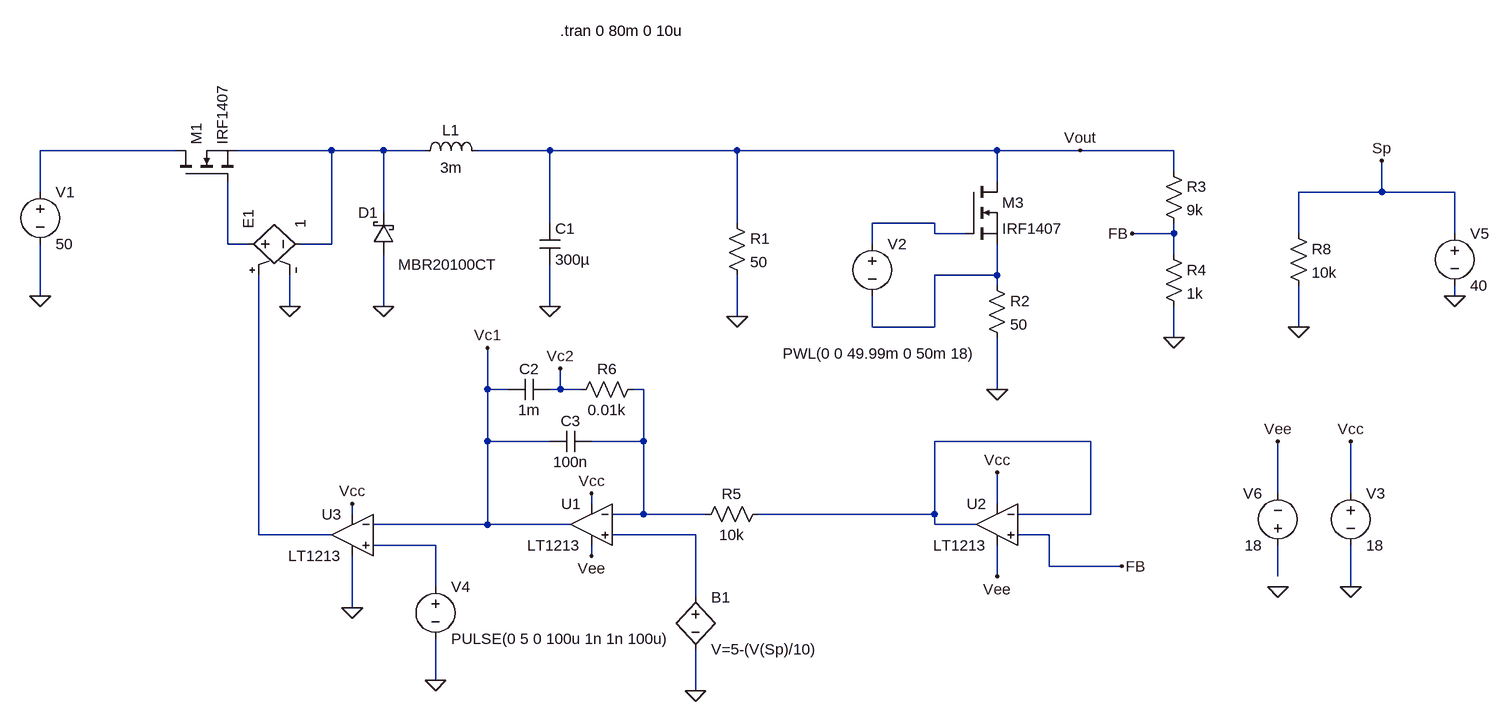
[diagram p0: schematic 12.BuckWithTypeII.asc]
12.BuckWithTypeII.asc, the LTspice schematic file:
Version 4
SHEET 1 2400 1028
WIRE 208 16 0 16
WIRE 448 16 304 16
WIRE 528 16 448 16
WIRE 592 16 528 16
WIRE 784 16 672 16
WIRE 1072 16 784 16
WIRE 1472 16 1072 16
WIRE 1600 16 1472 16
WIRE 1744 16 1600 16
WIRE 1744 48 1744 16
WIRE 1472 64 1472 16
WIRE 0 80 0 16
WIRE 2064 80 2064 32
WIRE 2064 80 1936 80
WIRE 2176 80 2064 80
WIRE 528 112 528 16
WIRE 784 128 784 16
WIRE 1072 128 1072 16
WIRE 1376 128 1280 128
WIRE 1376 144 1376 128
WIRE 1424 144 1376 144
WIRE 1744 144 1744 128
WIRE 1744 144 1680 144
WIRE 1936 144 1936 80
WIRE 2176 144 2176 80
WIRE 288 160 288 64
WIRE 320 160 288 160
WIRE 448 160 448 16
WIRE 448 160 400 160
WIRE 1280 160 1280 128
WIRE 1744 176 1744 144
WIRE 1472 208 1472 160
WIRE 1472 208 1376 208
WIRE 1472 224 1472 208
WIRE 0 240 0 160
WIRE 2176 240 2176 224
WIRE 384 256 384 208
WIRE 528 256 528 176
WIRE 784 256 784 192
WIRE 1072 272 1072 208
WIRE 1280 288 1280 240
WIRE 1376 288 1376 208
WIRE 1376 288 1280 288
WIRE 1936 288 1936 224
WIRE 1744 304 1744 256
WIRE 688 384 688 320
WIRE 720 384 688 384
WIRE 800 384 800 352
WIRE 800 384 784 384
WIRE 832 384 800 384
WIRE 928 384 912 384
WIRE 1472 384 1472 304
WIRE 688 464 688 384
WIRE 784 464 688 464
WIRE 928 464 928 384
WIRE 928 464 848 464
WIRE 1616 464 1376 464
WIRE 1904 544 1904 464
WIRE 2016 544 2016 464
WIRE 848 560 848 544
WIRE 1472 560 1472 512
WIRE 480 576 480 560
WIRE 928 576 928 464
WIRE 928 576 880 576
WIRE 1024 576 928 576
WIRE 1376 576 1376 464
WIRE 1376 576 1104 576
WIRE 1616 576 1616 464
WIRE 1616 576 1504 576
WIRE 688 592 688 464
WIRE 688 592 512 592
WIRE 816 592 688 592
WIRE 1376 592 1376 576
WIRE 1440 592 1376 592
WIRE 336 608 336 208
WIRE 448 608 336 608
WIRE 1008 608 880 608
WIRE 1552 608 1504 608
WIRE 608 624 512 624
WIRE 848 640 848 624
WIRE 1552 656 1552 608
WIRE 1664 656 1552 656
WIRE 1472 672 1472 624
WIRE 1904 672 1904 624
WIRE 608 688 608 624
WIRE 2016 688 2016 624
WIRE 1008 704 1008 608
WIRE 480 720 480 640
WIRE 608 832 608 768
WIRE 1008 848 1008 784
FLAG 0 240 0
FLAG 528 256 0
FLAG 784 256 0
FLAG 1072 272 0
FLAG 1472 384 0
FLAG 1744 304 0
FLAG 1680 144 FB
FLAG 1008 848 0
FLAG 608 832 0
FLAG 1936 288 0
FLAG 2176 240 0
FLAG 2064 32 Sp
FLAG 848 544 Vcc
FLAG 848 640 Vee
FLAG 480 560 Vcc
FLAG 384 256 0
FLAG 2016 688 0
FLAG 1904 688 0
FLAG 2016 464 Vcc
FLAG 1904 464 Vee
FLAG 480 720 0
FLAG 1600 16 Vout
FLAG 688 320 Vc1
FLAG 800 352 Vc2
FLAG 1472 512 Vcc
FLAG 1472 672 Vee
FLAG 1664 656 FB
SYMBOL voltage 0 64 R0
WINDOW 123 0 0 Left 0
WINDOW 39 0 0 Left 0
SYMATTR InstName V1
SYMATTR Value 50
SYMBOL nmos 208 64 R270
SYMATTR InstName M1
SYMATTR Value IRF1407
SYMBOL schottky 544 176 R180
WINDOW 0 24 64 Left 2
WINDOW 3 -160 -16 Left 2
SYMATTR InstName D1
SYMATTR Value MBR20100CT
SYMATTR Description Diode
SYMATTR Type diode
SYMBOL ind 576 32 R270
WINDOW 0 32 56 VTop 2
WINDOW 3 5 56 VBottom 2
SYMATTR InstName L1
SYMATTR Value 3m
SYMBOL cap 768 128 R0
SYMATTR InstName C1
SYMATTR Value 300µ
SYMBOL res 1056 112 R0
SYMATTR InstName R1
SYMATTR Value 50
SYMBOL res 1456 208 R0
SYMATTR InstName R2
SYMATTR Value 50
SYMBOL voltage 1280 144 R0
WINDOW 3 -138 185 Left 2
WINDOW 123 0 0 Left 0
WINDOW 39 0 0 Left 0
SYMATTR InstName V2
SYMATTR Value PWL(0 0 49.99m 0 50m 18)
SYMBOL res 1728 32 R0
SYMATTR InstName R3
SYMATTR Value 9k
SYMBOL res 1728 160 R0
SYMATTR InstName R4
SYMATTR Value 1k
SYMBOL nmos 1424 64 R0
SYMATTR InstName M3
SYMATTR Value IRF1407
SYMBOL OpAmps\\LT1213 848 528 M0
SYMATTR InstName U1
SYMBOL res 1120 560 R90
WINDOW 0 0 56 VBottom 2
WINDOW 3 32 56 VTop 2
SYMATTR InstName R5
SYMATTR Value 10k
SYMBOL res 928 368 R90
WINDOW 0 0 56 VBottom 2
WINDOW 3 32 56 VTop 2
SYMATTR InstName R6
SYMATTR Value 0.01k
SYMBOL cap 784 368 R90
WINDOW 0 0 32 VBottom 2
WINDOW 3 32 32 VTop 2
SYMATTR InstName C2
SYMATTR Value 1m
SYMBOL voltage 608 672 R0
WINDOW 123 0 0 Left 0
WINDOW 39 0 0 Left 0
SYMATTR InstName V4
SYMATTR Value PULSE(0 5 0 100u 1n 1n 100u)
SYMBOL voltage 2176 128 R0
SYMATTR InstName V5
SYMATTR Value 40
SYMBOL res 1920 128 R0
SYMATTR InstName R8
SYMATTR Value 10k
SYMBOL OpAmps\\LT1213 480 544 M0
SYMATTR InstName U3
SYMBOL e 304 160 R270
SYMATTR InstName E1
SYMATTR Value 1
SYMBOL bv 1008 688 R0
SYMATTR InstName B1
SYMATTR Value V=5-(V(Sp)/10)
SYMBOL cap 848 448 R90
WINDOW 0 0 32 VBottom 2
WINDOW 3 32 32 VTop 2
SYMATTR InstName C3
SYMATTR Value 100n
SYMBOL voltage 2016 528 R0
SYMATTR InstName V3
SYMATTR Value 18
SYMBOL voltage 1904 640 R180
WINDOW 0 24 96 Left 2
WINDOW 3 24 16 Left 2
SYMATTR InstName V6
SYMATTR Value 18
SYMBOL OpAmps\\LT1213 1472 528 M0
SYMATTR InstName U2
TEXT 800 -168 Left 2 !.tran 0 80m 0 10u

The netlist it stands for:
* 12.BuckWithTypeII.asc
V1 N001 0 50
M1 N001 N004 N002 N002 IRF1407
D1 0 N002 MBR20100CT
L1 N002 Vout 3m
C1 Vout 0 300µ
R1 Vout 0 50
R2 N005 0 50
V2 N003 N005 PWL(0 0 49.99m 0 50m 18)
R3 Vout FB 9k
R4 FB 0 1k
M3 Vout N003 N005 N005 IRF1407
XU1 N009 N006 Vcc Vee Vc1 LT1213  ; pins In+ In- V+ V- OUT
R5 N007 N006 10k
R6 N006 Vc2 0.01k
C2 Vc2 Vc1 1m
V4 N010 0 PULSE(0 5 0 100u 1n 1n 100u)
V5 Sp 0 40
R8 Sp 0 10k
XU3 N010 Vc1 Vcc 0 N008 LT1213  ; pins In+ In- V+ V- OUT
E1 N004 N002 N008 0 1
B1 N009 0 V=5-(V(Sp)/10)
C3 N006 Vc1 100n
V3 Vcc 0 18
V6 N011 Vee 18
XU2 FB N007 Vcc Vee N007 LT1213  ; pins In+ In- V+ V- OUT
.model D D
.lib standard.dio
.model NMOS NMOS
.model PMOS PMOS
.lib standard.mos
.tran 0 80m 0 10u
.lib LTC.lib
.backanno
.end